# Altium project SkyPulseUAV_Motherboard.PrjPcb
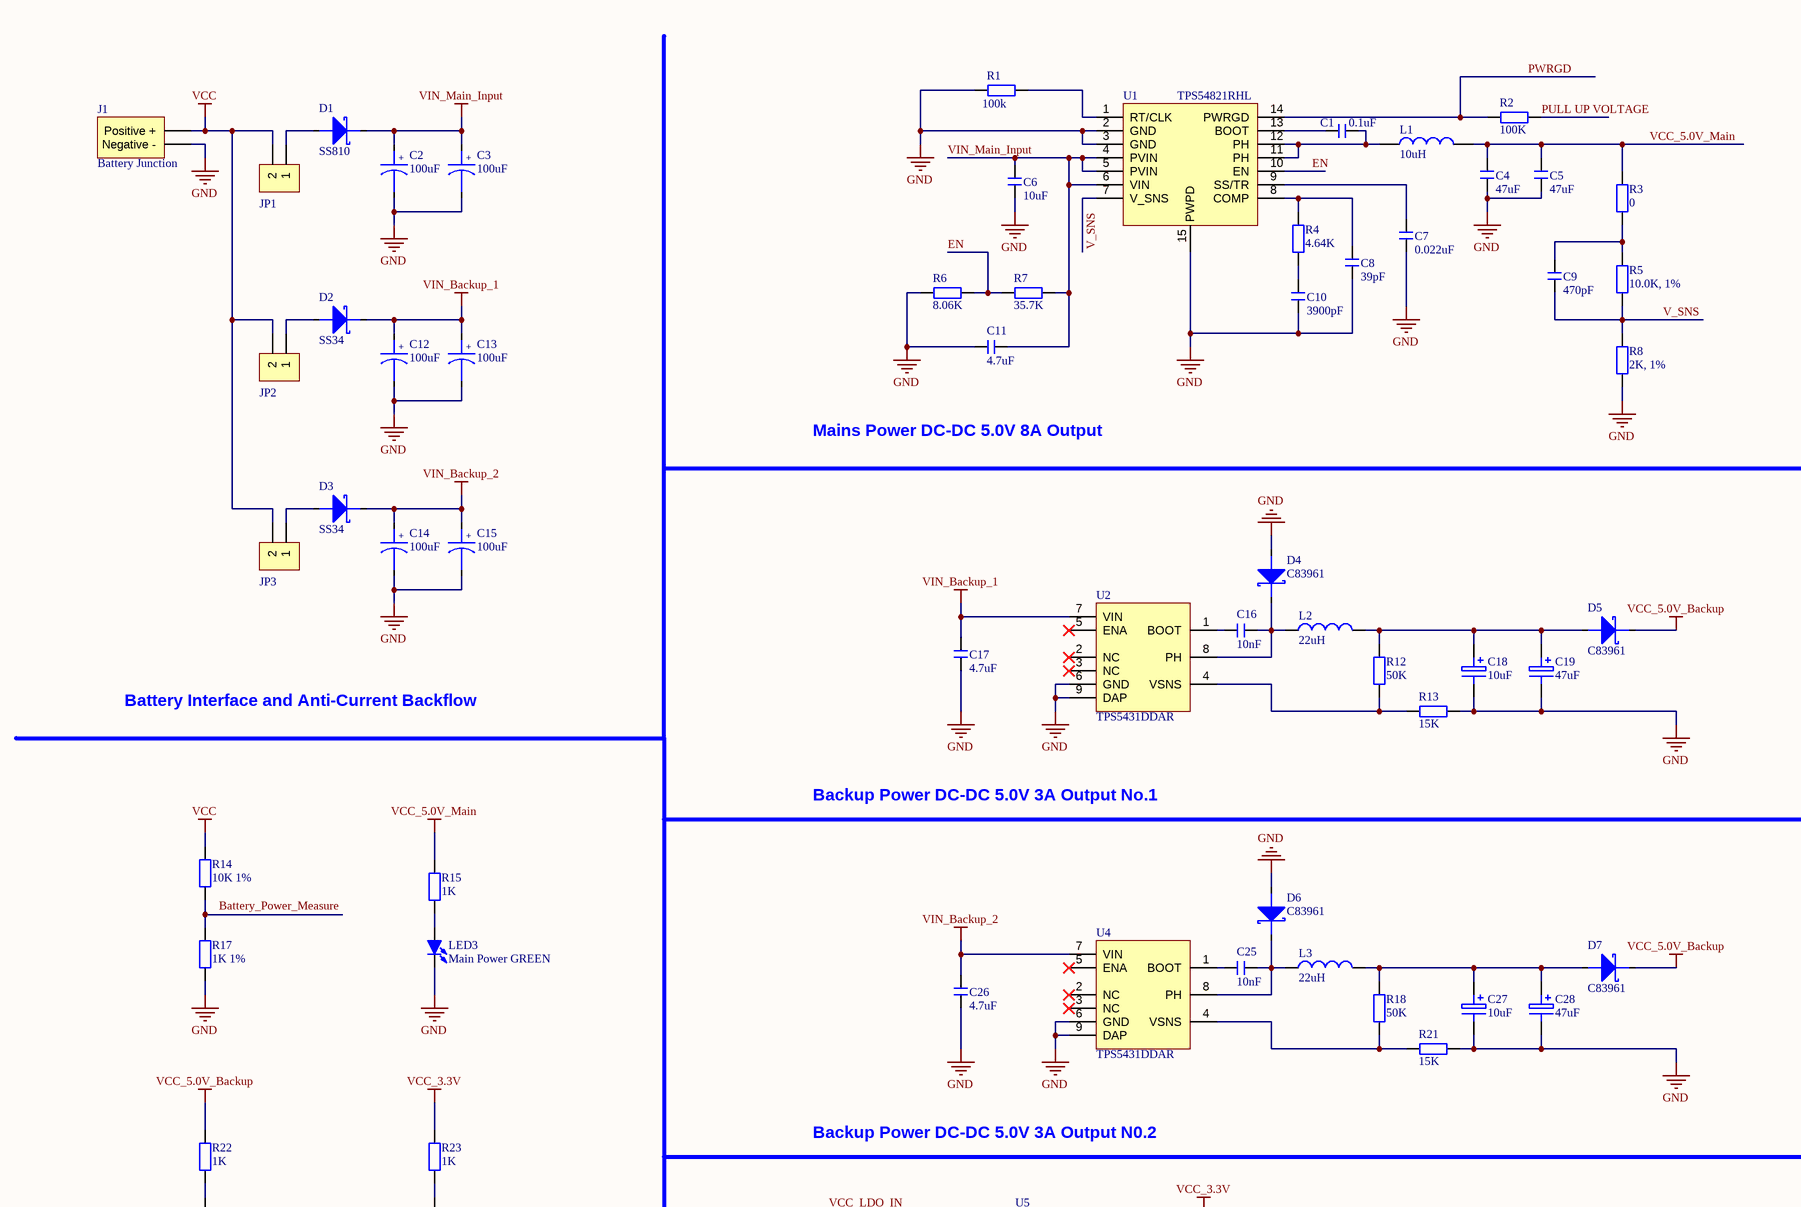
[diagram p0: SkyPulseUAV_Motherboard.SchDoc, top left]
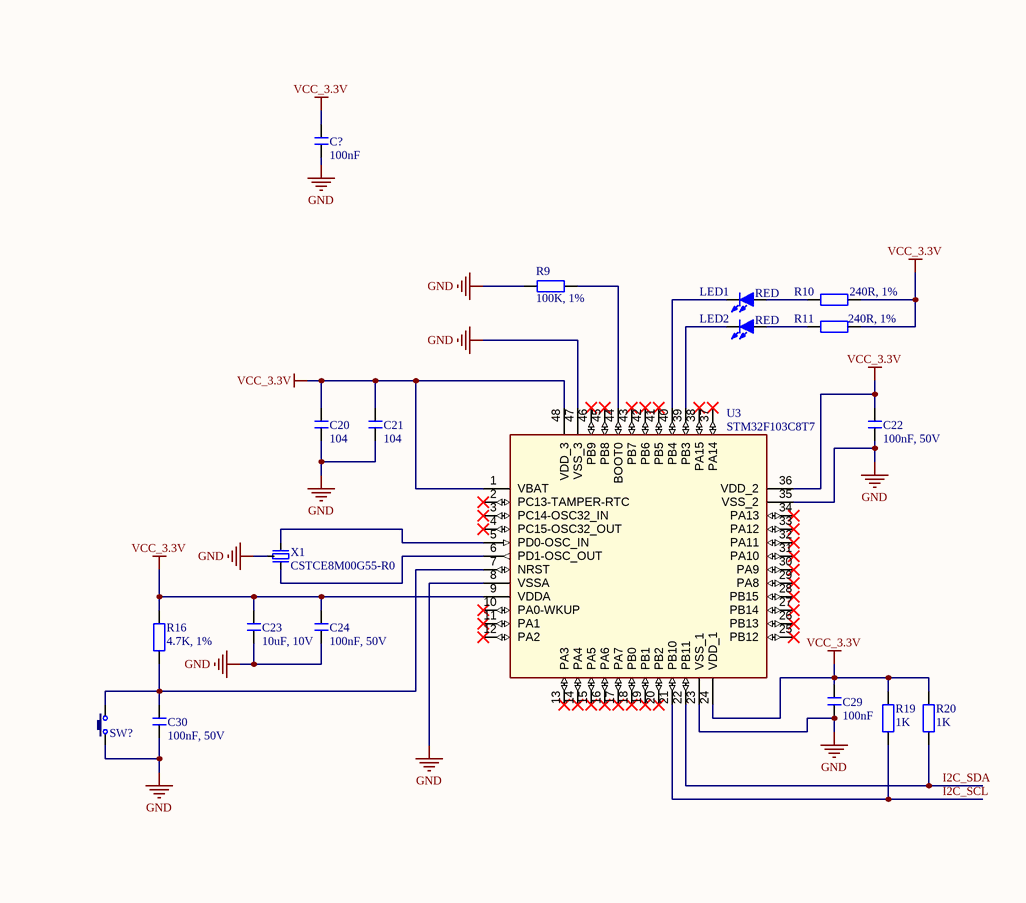
[diagram p1: SkyPulseUAV_Motherboard.SchDoc, top right]
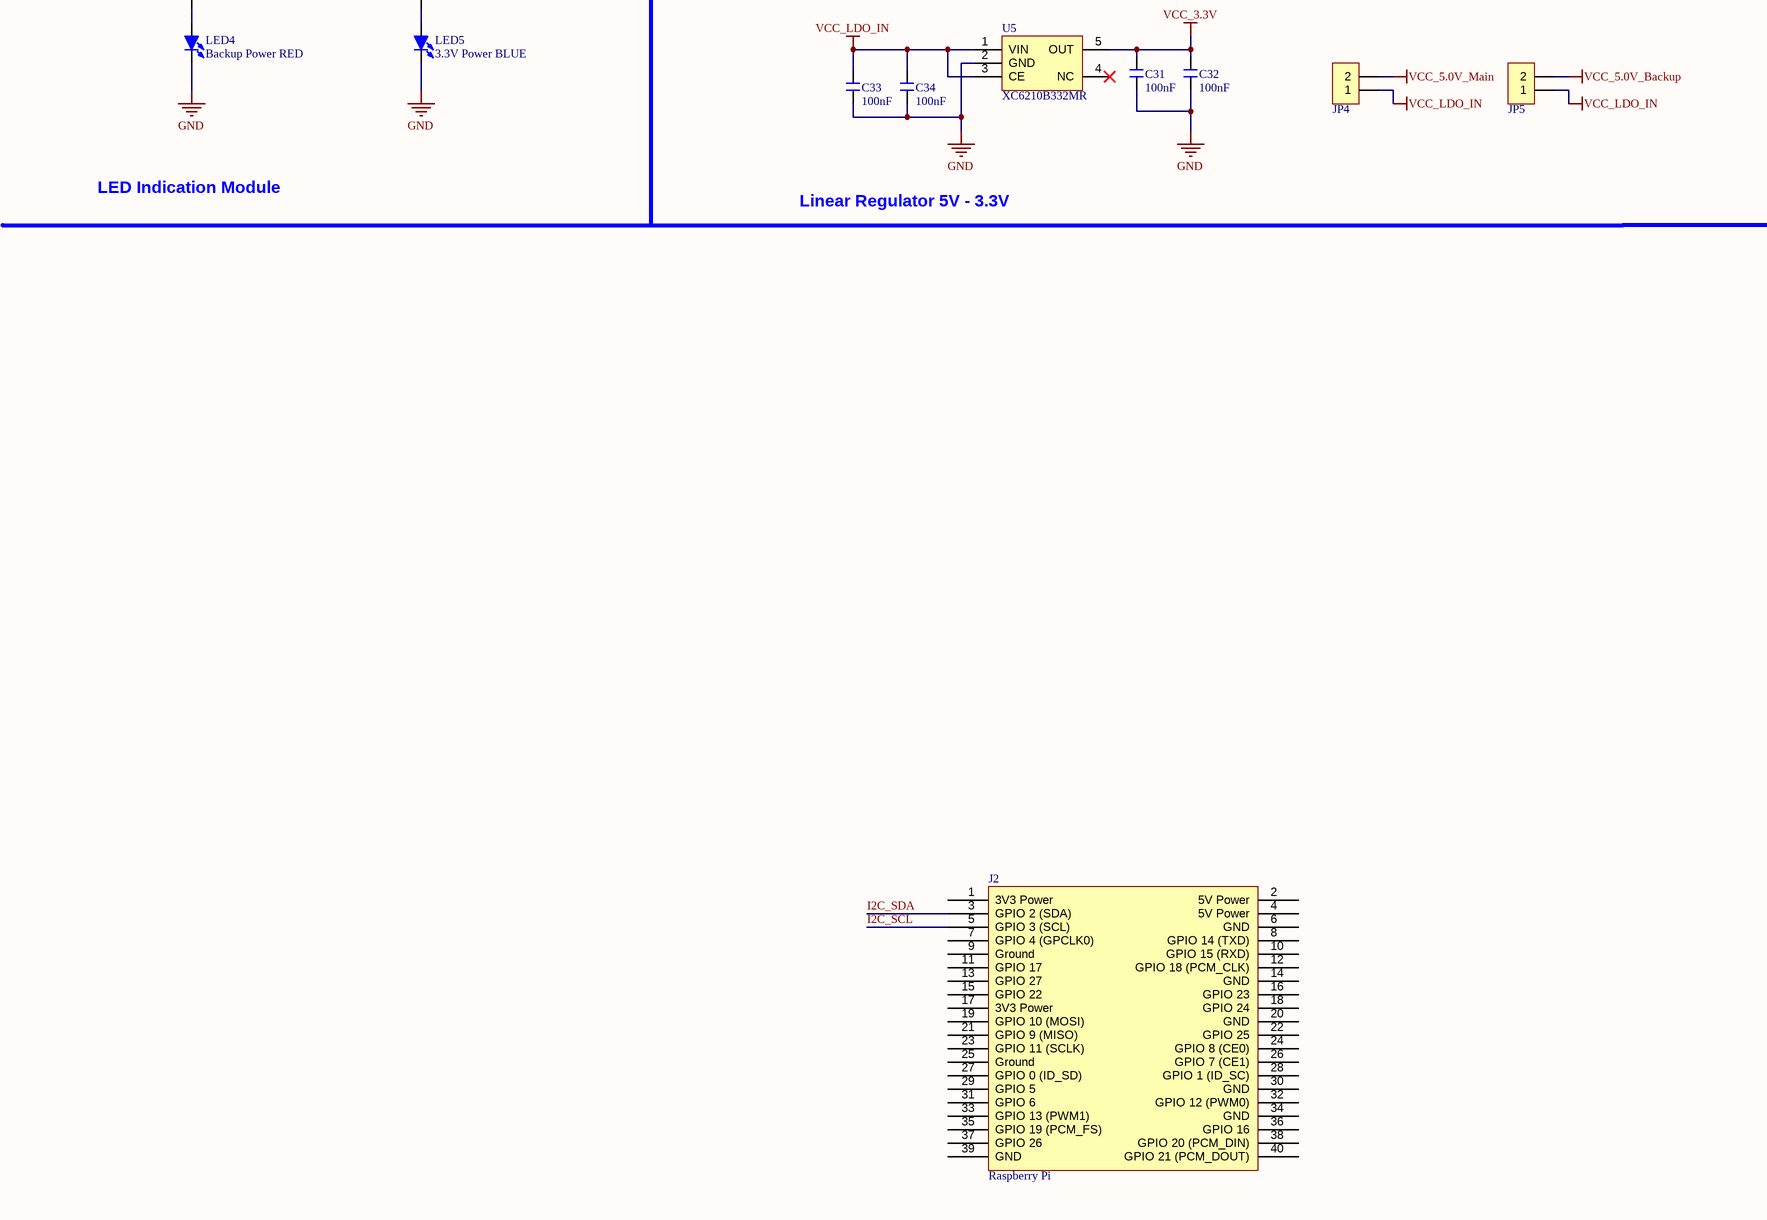
[diagram p2: SkyPulseUAV_Motherboard.SchDoc, bottom left]
4 sheets, 154 parts. Net scope: flat (ports and power ports of the same name join across sheets).
Board file: Motherboard_PCB.PcbDoc
Sheets:
  SkyPulseUAV_Motherboard.SchDoc
  SkyPulseUAV_PowerModule.SchDoc
  SkyPulseUAV_MCU.SchDoc
  SkyPulseUAV_Connector.SchDoc

## Sheet SkyPulseUAV_Motherboard.SchDoc
size 863 x 558 mm; SheetNumber: 1; SheetTotal: 1

### Parts
(Parts that share a designator on the sheet are numbered #1, #2 ... from top to bottom, then left to right.)
C1#1  0.1uF  [C 0805_M]
C2#1  100uF  [CM D(6.3*7.7)]
C3#1  100uF  [CM D(6.3*7.7)]
C4#1  47uF  [C 0805_M]
C5#1  47uF  [C 0805_M]
C6#1  10uF  [C 0805_M]
C7#1  0.022uF  [C 0805_M]
C8#1  39pF  [C 0805_M]
C9#1  470pF  [C 0805_M]
C10#1  3900pF  [C 0805_M]
C11#1  4.7uF  [C 0805_M]
C12#1  100uF  [CM D(6.3*7.7)]
C13#1  100uF  [CM D(6.3*7.7)]
C14#1  100uF  [CM D(6.3*7.7)]
C15#1  100uF  [CM D(6.3*7.7)]
C16#1  10nF  [C 0805_M]
C17#1  4.7uF  [C 0805_M]
C18#1  10uF  [CD B(3528)]
C19#1  47uF  [CD D(7343)]
C20#1  104  [C 0805_M]
C21#1  104  [C 0805_M]
C22#1  100nF, 50V  [C 0805_M]
C23#1  10uF, 10V  [C 0805_M]
C24#1  100nF, 50V  [C 0805_M]
C25#1  10nF  [C 0805_M]
C26#1  4.7uF  [C 0805_M]
C27#1  10uF  [CD B(3528)]
C28#1  47uF  [CD D(7343)]
C29  100nF  [C 0805_M]
C30  100nF, 50V  [C 0805_M]
C31  100nF  [C 0805_M]
C32  100nF  [C 0805_M]
C33  100nF  [C 0603_M]
C34  100nF  [C 0805_M]
C?  100nF  [C 0805_M]
D1#1  SS810  [SMB]
D2#1  SS34  [SMA]
D3#1  SS34  [SMA]
D4#1  C83961  [SMA]
D5  C83961  [SMA]
D6  C83961  [SMA]
D7  C83961  [SMA]
J1#1  Battery Junction
J2#1  Raspberry Pi
JP1  HDR-1X2  (value not drawn)
JP2  HDR-1X2  (value not drawn)
JP3  HDR-1X2  (value not drawn)
JP4  HDR-1X2  (value not drawn)
JP5  HDR-1X2  (value not drawn)
L1#1  10uH  [CD54]
L2#1  22uH  [CD54]
L3  22uH  [CD54]
LED1#1  RED  [LED 0805B]
LED2#1  RED  [LED 0805B]
LED3#1  Main Power GREEN  [LED 0805G]
LED4#1  Backup Power RED  [LED 0805R]
LED5#1  3.3V Power BLUE  [LED 0805B]
R1#1  100k  [R 0805_M]
R2#1  100K  [R 0805_M]
R3#1  0  [R 0805_M]
R4#1  4.64K  [R 0805_M]
R5#1  10.0K, 1%  [R 0805_M]
R6#1  8.06K  [R 0805_M]
R7#1  35.7K  [R 0805_M]
R8#1  2K, 1%  [R 0805_M]
R9#1  100K, 1%  [R 0805_M]
R10#1  240R, 1%  [R 0805_M]
R11#1  240R, 1%  [R 0805_M]
R12#1  50K  [R 0805_M]
R13#1  15K  [R 0805_M]
R14#1  10K 1%  [R 0805_M]
R15#1  1K  [R 0805_M]
R16#1  4.7K, 1%  [R 0805_M]
R17#1  1K 1%  [R 0805_M]
R18#1  50K  [R 0805_M]
R19#1  1K  [R 0805_M]
R20#1  1K  [R 0805_M]
R21#1  15K  [R 0805_M]
R22  1K  [R 0805_M]
R23  1K  [R 0805_M]
SW?  3x6x5  (value not drawn)
U1#1  TPS54821RHL
U2#1  TPS5431DDAR
U3#1  STM32F103C8T7  [TSQFP50P900X900X160-48L]
U4#1  TPS5431DDAR
U5  XC6210B332MR
X1#1  CSTCE8M00G55-R0  [CSTCE_G]

### Nets
GND: C2#1.2 C3#1.2 C4#1.1 C5#1.1 C6#1.1 C7#1.1 C8#1.1 C10#1.1 C11#1.1 C12#1.2 C13#1.2 C14#1.2 C15#1.2 C17#1.1 C18#1.2(E) C19#1.2(E) C20#1.1 C21#1.1 C22#1.1 C23#1.1 C24#1.1 C26#1.1 C27#1.2(E) C28#1.2(E) C29.2 C30.1 C31.2 C32.2 C33.1 C34.1 C?.1 D4#1.1 D6.1 J1#1.2(Negative_-) LED3#1.2(K) LED4#1.2(K) LED5#1.2(K) R1#1.1 R6#1.1 R8#1.1 R9#1.1 R13#1.1 R17#1.1 R21#1.1 SW?.2 U1#1.2(GND) U1#1.3(GND) U1#1.15(PWPD) U2#1.6(GND) U2#1.9(DAP) U3#1.8(VSSA) U3#1.23(VSS_1) U3#1.35(VSS_2) U3#1.47(VSS_3) U4#1.6(GND) U4#1.9(DAP) U5.2(GND) X1#1.2(GND)
VCC: J1#1.1(Positive_+) JP1.2 JP2.2 JP3.2 R14#1.2
VCC_3.3V: C20#1.2 C21#1.2 C22#1.2 C23#1.2 C24#1.2 C29.1 C31.1 C32.1 C?.2 R10#1.2 R11#1.2 R16#1.2 R19#1.2 R20#1.2 R23.2 U3#1.1(VBAT) U3#1.9(VDDA) U3#1.24(VDD_1) U3#1.36(VDD_2) U3#1.48(VDD_3) U5.5(OUT)
VCC_5.0V_Backup: D5.2 D7.2 JP5.2 R22.2
VCC_5.0V_Main: C4#1.2 C5#1.2 JP4.2 L1#1.2 R3#1.2 R15#1.2
VCC_LDO_IN: C33.2 C34.2 JP4.1 JP5.1 U5.1(VIN) U5.3(CE)
VIN_Backup_1: C12#1.1 C13#1.1 C17#1.2 D2#1.2 U2#1.7(VIN)
VIN_Backup_2: C14#1.1 C15#1.1 C26#1.2 D3#1.2 U4#1.7(VIN)
VIN_Main_Input: C2#1.1 C3#1.1 C6#1.2 C11#1.2 D1#1.2 R7#1.2 U1#1.4(PVIN) U1#1.5(PVIN) U1#1.6(VIN)
EN: R6#1.2 R7#1.1 U1#1.10(EN)
I2C_SCL: J2#1.5(GPIO_3_(SCL)) R19#1.1 U3#1.21(PB10)
I2C_SDA: J2#1.3(GPIO_2_(SDA)) R20#1.1 U3#1.22(PB11)
PULL UP VOLTAGE: R2#1.2
PWRGD: R2#1.1 U1#1.14(PWRGD)
V_SNS: C9#1.1 R5#1.1 R8#1.2 U1#1.7(V_SNS)
NetC1#1_1: C1#1.1 L1#1.1 U1#1.11(PH) U1#1.12(PH)
NetC1#1_2: C1#1.2 U1#1.13(BOOT)
NetC7#1_2: C7#1.2 U1#1.9(SS/TR)
NetC8#1_2: C8#1.2 R4#1.2 U1#1.8(COMP)
NetC9#1_2: C9#1.2 R3#1.1 R5#1.2
NetC10#1_2: C10#1.2 R4#1.1
NetC16#1_1: C16#1.1 U2#1.1(BOOT)
NetC16#1_2: C16#1.2 D4#1.2 L2#1.1 U2#1.8(PH)
NetC18#1_1: C18#1.1 C19#1.1 D5.1 L2#1.2 R12#1.2
NetC25#1_1: C25#1.1 U4#1.1(BOOT)
NetC25#1_2: C25#1.2 D6.2 L3.1 U4#1.8(PH)
NetC27#1_1: C27#1.1 C28#1.1 D7.1 L3.2 R18#1.2
NetC30_2: C30.2 R16#1.1 SW?.1 U3#1.7(NRST)
NetD1#1_1: D1#1.1 JP1.1
NetD2#1_1: D2#1.1 JP2.1
NetD3#1_1: D3#1.1 JP3.1
NetLED1#1_1: LED1#1.1(A) R10#1.1
NetLED1#1_2: LED1#1.2(K) U3#1.40(PB4)
NetLED2#1_1: LED2#1.1(A) R11#1.1
NetLED2#1_2: LED2#1.2(K) U3#1.39(PB3)
NetLED3#1_1: LED3#1.1(A) R15#1.1
NetLED4#1_1: LED4#1.1(A) R22.1
NetLED5#1_1: LED5#1.1(A) R23.1
NetR1#1_2: R1#1.2 U1#1.1(RT/CLK)
NetR9#1_2: R9#1.2 U3#1.44(BOOT0)
NetR12#1_1: R12#1.1 R13#1.2 U2#1.4(VSNS)
NetR14#1_1: R14#1.1 R17#1.2
NetR18#1_1: R18#1.1 R21#1.2 U4#1.4(VSNS)
NetU3#1_5: U3#1.5(PD0-OSC_IN) X1#1.1
NetU3#1_6: U3#1.6(PD1-OSC_OUT) X1#1.3

Not connected (* = marked no-connect by the designer): J2#1 1(3V3_Power) 2(5V_Power) 4(5V_Power) 6(GND) 7(GPIO_4_(GPCLK0)) 8(GPIO_14_(TXD)) 9(Ground) 10(GPIO_15_(RXD)) 11(GPIO_17) 12(GPIO_18_(PCM_CLK)) 13(GPIO_27) 14(GND) 15(GPIO_22) 16(GPIO_23) 17(3V3_Power) 18(GPIO_24) 19(GPIO_10_(MOSI)) 20(GND) 21(GPIO_9_(MISO)) 22(GPIO_25) 23(GPIO_11_(SCLK)) 24(GPIO_8_(CE0)) 25(Ground) 26(GPIO_7_(CE1)) 27(GPIO_0_(ID_SD)) 28(GPIO_1_(ID_SC)) 29(GPIO_5) 30(GND) 31(GPIO_6) 32(GPIO_12_(PWM0)) 33(GPIO_13_(PWM1)) 34(GND) 35(GPIO_19_(PCM_FS)) 36(GPIO_16) 37(GPIO_26) 38(GPIO_20_(PCM_DIN)) 39(GND) 40(GPIO_21_(PCM_DOUT)); U2#1 2(NC)* 3(NC)* 5(ENA)*; U3#1 2(PC13-TAMPER-RTC)* 3(PC14-OSC32_IN)* 4(PC15-OSC32_OUT)* 10(PA0-WKUP)* 11(PA1)* 12(PA2)* 13(PA3)* 14(PA4)* 15(PA5)* 16(PA6)* 17(PA7)* 18(PB0)* 19(PB1)* 20(PB2)* 25(PB12)* 26(PB13)* 27(PB14)* 28(PB15)* 29(PA8)* 30(PA9)* 31(PA10)* 32(PA11)* 33(PA12)* 34(PA13)* 37(PA14)* 38(PA15)* 41(PB5)* 42(PB6)* 43(PB7)* 45(PB8)* 46(PB9)*; U4#1 2(NC)* 3(NC)* 5(ENA)*; U5 4(NC)*

### Notes on the sheet
- Mains Power DC-DC 5.0V 8A Output
- Battery Interface and Anti-Current Backflow
- Backup Power DC-DC 5.0V 3A Output No.1
- Backup Power DC-DC 5.0V 3A Output N0.2
- LED Indication Module
- Linear Regulator 5V - 3.3V
- Labels drawn without touching a wire or pin: Battery_Power_Measure
- TITLE:
- SIZE
- D
- AUTHOR:
- REVISION:
- DATA:
- FILE NAME:
- SHEET
- OF
- (in symbol CAP_Electrolytic) +

### Library data of the parts
C1#1 C4#1 C5#1 C6#1 C7#1 C8#1 C9#1 C10#1 C11#1 C16#1 C17#1 C20#1 C21#1 C22#1 C23#1 C24#1 C25#1 C26#1 C29-C34 C? = CAP: SMD Capacitor
C2#1 C3#1 C12#1 C13#1 C14#1 C15#1 = CAP_Electrolytic: SMD Aluminum Electrolytic Capacitors
C18#1 C27#1 = CAP_TAN_10uF: Tantalum capacitor, 10uF, 16V, CA45A-B-16V-10uF-K; Model: CA45A-B-16V-10uF-K
C19#1 C28#1 = CAP_TAN: Tantalum capacitor, 47uF, 16V
D1#1 = SS810: SURFACE MOUNT SCHOTTKY BARRIER RECTIFIER, 8A
D2#1 D3#1 D4#1 D5-D7 = SS34: SURFACE MOUNT SCHOTTKY BARRIER RECTIFIER
J1#1 = Battery Junction: 7.4V, 2S1P, 38.48Wh, 80C, 5200mAh
J2#1 = Raspberry Pi Connector: Raspberry Pi Connector, 40P
JP1-JP5 = Header 2: 2P Jumper
L1#1 L2#1 L3 = L: Inductance
LED1#1 LED2#1 = LED: SMD LED Red
LED3#1 = LED: SMD LED Green
LED4#1 LED5#1 = LED_SMD: SMD LED Red
R1#1 R2#1 R3#1 R4#1 R5#1 R6#1 R7#1 R8#1 R9#1 R10#1 R11#1 R12#1 R13#1 R16#1 R18#1 R19#1 R20#1 R21#1 = RES: SMD Resistor
R14#1 R15#1 R17#1 R22 R23 = RES: SMD Resistor; BOM名称: 贴片电阻; 版权归属: 源创客; 学习资源: www.ooocke.com
SW? = TSW 3x6: Switch
U1#1 = TPS54821RHL: 4.5 V to 17 V Input, 8 A Synchronous Step Down Converter With Hiccup
U2#1 U4#1 = TPS5431DDAR: TPS543x 3A, Wide Input Range, Step-Down Converter
U5 = XC6210B332MR: 800mA, 25uA, Higt PSRR Voltage Regulator
X1#1 = CSTCE8M00G55-R0: Crystal Oscillator CSTCE8M00G55-R0

## Sheet SkyPulseUAV_PowerModule.SchDoc: SkyPulseUAV_Power
size A4; Date: March 2, 2024; Author: Binhan Tian; Revision: V0.2; SheetNumber: 2; SheetTotal: 4
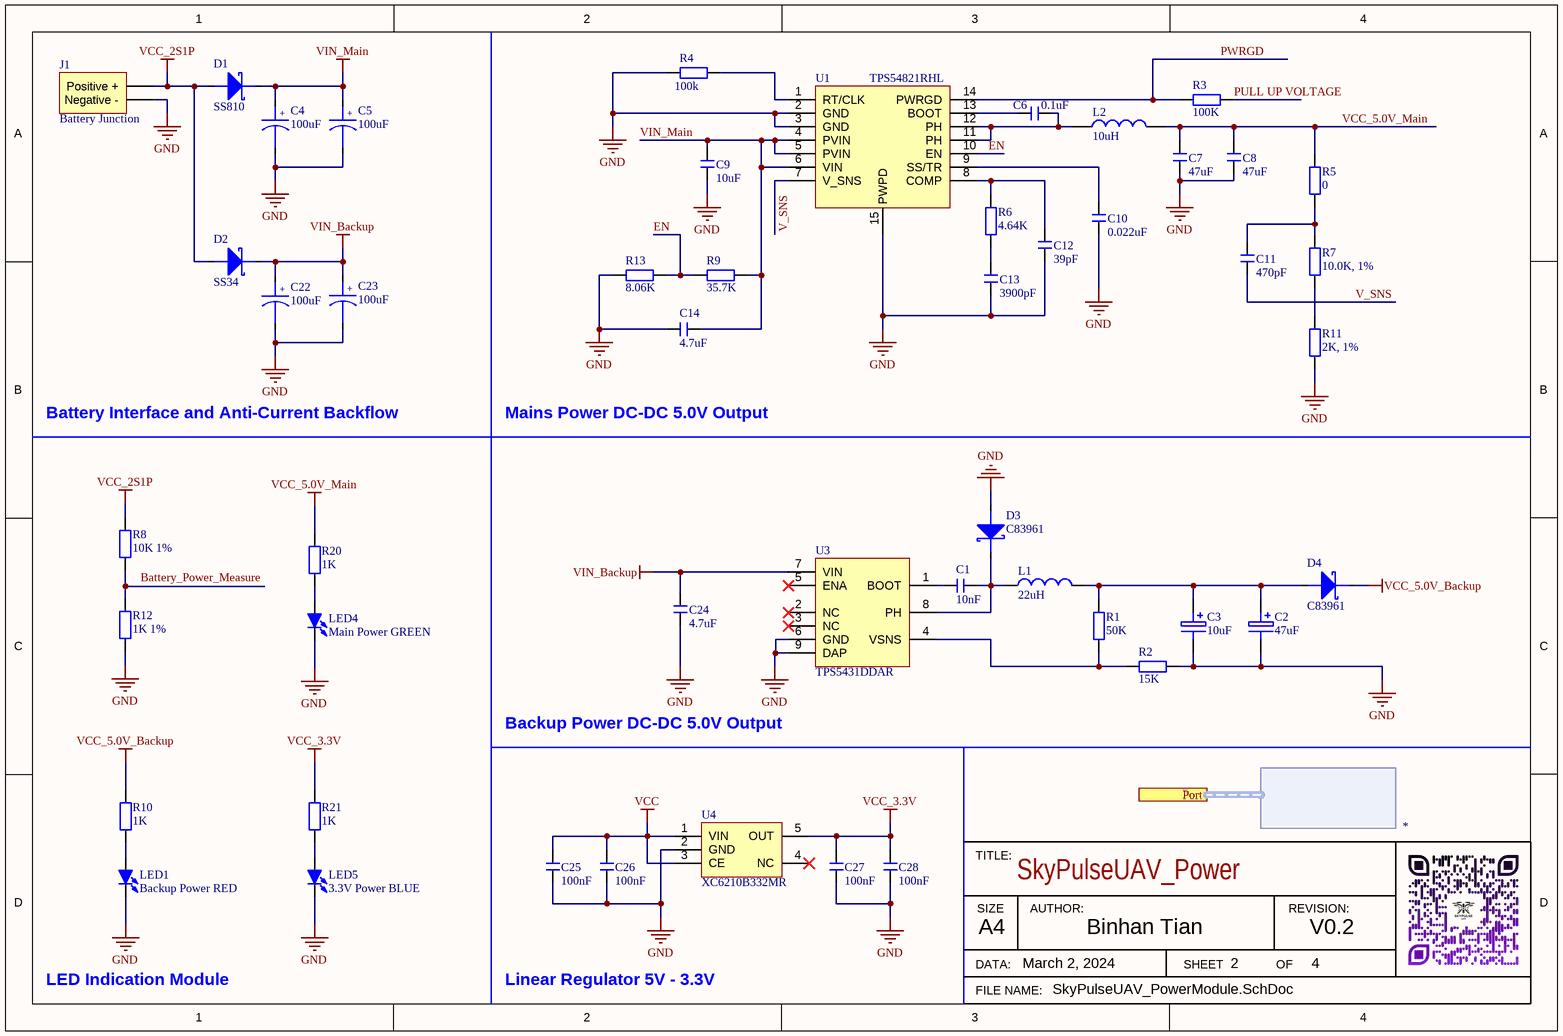
[diagram p3: SkyPulseUAV_PowerModule.SchDoc]

### Parts
(Parts that share a designator on the sheet are numbered #1, #2 ... from top to bottom, then left to right.)
C1#2  10nF  [C 0805_M]
C2#2  47uF  [CD D(7343)]
C3#2  10uF  [CD B(3528)]
C4#2  100uF  [CM D(6.3*7.7)]
C5#2  100uF  [CM D(6.3*7.7)]
C6#2  0.1uF  [C 0805_M]
C7#2  47uF  [C 0805_M]
C8#2  47uF  [C 0805_M]
C9#2  10uF  [C 0805_M]
C10#2  0.022uF  [C 0805_M]
C11#2  470pF  [C 0805_M]
C12#2  39pF  [C 0805_M]
C13#2  3900pF  [C 0805_M]
C14#2  4.7uF  [C 0805_M]
C22#2  100uF  [CM D(6.3*7.7)]
C23#2  100uF  [CM D(6.3*7.7)]
C24#2  4.7uF  [C 0805_M]
C25#2  100nF  [C 0603_M]
C26#2  100nF  [C 0805_M]
C27#2  100nF  [C 0805_M]
C28#2  100nF  [C 0805_M]
D1#2  SS810  [SMB]
D2#2  SS34  [SMA]
D3#2  C83961  [SMA]
D4#2  C83961  [SMA]
J1#2  Battery Junction
L1#2  22uH  [CD54]
L2#2  10uH  [CD54]
LED1#2  Backup Power RED  [LED 0805R]
LED4#2  Main Power GREEN  [LED 0805G]
LED5#2  3.3V Power BLUE  [LED 0805B]
R1#2  50K  [R 0805_M]
R2#2  15K  [R 0805_M]
R3#2  100K  [R 0805_M]
R4#2  100k  [R 0805_M]
R5#2  0  [R 0805_M]
R6#2  4.64K  [R 0805_M]
R7#2  10.0K, 1%  [R 0805_M]
R8#2  10K 1%  [R 0805_M]
R9#2  35.7K  [R 0805_M]
R10#2  1K  [R 0805_M]
R11#2  2K, 1%  [R 0805_M]
R12#2  1K 1%  [R 0805_M]
R13#2  8.06K  [R 0805_M]
R20#2  1K  [R 0805_M]
R21#2  1K  [R 0805_M]
U1#2  TPS54821RHL
U3#2  TPS5431DDAR
U4#2  XC6210B332MR

### Ports
Port (harness *)

### Harnesses
*: 

### Nets
GND: C2#2.2(E) C3#2.2(E) C4#2.2 C5#2.2 C7#2.1 C8#2.1 C9#2.1 C10#2.1 C12#2.1 C13#2.1 C14#2.1 C22#2.2 C23#2.2 C24#2.1 C25#2.1 C26#2.1 C27#2.2 C28#2.2 D3#2.1 J1#2.2(Negative_-) LED1#2.2(K) LED4#2.2(K) LED5#2.2(K) R2#2.1 R4#2.1 R11#2.1 R12#2.1 R13#2.1 U1#2.2(GND) U1#2.3(GND) U1#2.15(PWPD) U3#2.6(GND) U3#2.9(DAP) U4#2.2(GND)
VCC: C25#2.2 C26#2.2 U4#2.1(VIN) U4#2.3(CE)
VCC_2S1P: D1#2.1 D2#2.1 J1#2.1(Positive_+) R8#2.2
VCC_3.3V: C27#2.1 C28#2.1 R21#2.2 U4#2.5(OUT)
VCC_5.0V_Backup: D4#2.2 R10#2.2
VCC_5.0V_Main: C7#2.2 C8#2.2 L2#2.2 R5#2.2 R20#2.2
VIN_Backup: C22#2.1 C23#2.1 C24#2.2 D2#2.2 U3#2.7(VIN)
VIN_Main: C4#2.1 C5#2.1 C9#2.2 C14#2.2 D1#2.2 R9#2.2 U1#2.4(PVIN) U1#2.5(PVIN) U1#2.6(VIN)
EN: R9#2.1 R13#2.2 U1#2.10(EN)
PULL UP VOLTAGE: R3#2.2
PWRGD: R3#2.1 U1#2.14(PWRGD)
V_SNS: C11#2.1 U1#2.7(V_SNS)
NetC1#2_1: C1#2.1 U3#2.1(BOOT)
NetC1#2_2: C1#2.2 D3#2.2 L1#2.1 U3#2.8(PH)
NetC2#2_1: C2#2.1 C3#2.1 D4#2.1 L1#2.2 R1#2.2
NetC6#2_1: C6#2.1 L2#2.1 U1#2.11(PH) U1#2.12(PH)
NetC6#2_2: C6#2.2 U1#2.13(BOOT)
NetC10#2_2: C10#2.2 U1#2.9(SS/TR)
NetC11#2_2: C11#2.2 R5#2.1 R7#2.2
NetC12#2_2: C12#2.2 R6#2.2 U1#2.8(COMP)
NetC13#2_2: C13#2.2 R6#2.1
NetLED1#2_1: LED1#2.1(A) R10#2.1
NetLED4#2_1: LED4#2.1(A) R20#2.1
NetLED5#2_1: LED5#2.1(A) R21#2.1
NetR1#2_1: R1#2.1 R2#2.2 U3#2.4(VSNS)
NetR4#2_2: R4#2.2 U1#2.1(RT/CLK)
NetR7#2_1: R7#2.1 R11#2.2
NetR8#2_1: R8#2.1 R12#2.2

Not connected (* = marked no-connect by the designer): U3#2 2(NC)* 3(NC)* 5(ENA)*; U4#2 4(NC)*

### Notes on the sheet
- Battery Interface and Anti-Current Backflow
- Mains Power DC-DC 5.0V Output
- Backup Power DC-DC 5.0V Output
- LED Indication Module
- Linear Regulator 5V - 3.3V
- Labels drawn without touching a wire or pin: Battery_Power_Measure
- TITLE:
- SIZE
- AUTHOR:
- REVISION:
- DATA:
- FILE NAME:
- A4
- SHEET
- OF
- (in symbol CAP_Electrolytic) +

### Library data of the parts
C1#2 C6#2 C7#2 C8#2 C9#2 C10#2 C11#2 C12#2 C13#2 C14#2 C24#2 C25#2 C26#2 C27#2 C28#2 = CAP: SMD Capacitor
C2#2 = CAP_TAN: Tantalum capacitor, 47uF, 16V
C3#2 = CAP_TAN_10uF: as C18#1 on sheet SkyPulseUAV_Motherboard; Model: CA45A-B-16V-10uF-K
C4#2 C5#2 C22#2 C23#2 = CAP_Electrolytic: SMD Aluminum Electrolytic Capacitors
D1#2 = SS810: as D1#1 on sheet SkyPulseUAV_Motherboard
D2#2 D3#2 D4#2 = SS34: SURFACE MOUNT SCHOTTKY BARRIER RECTIFIER
J1#2 = Battery Junction: 7.4V, 2S1P, 38.48Wh, 80C, 5200mAh
L1#2 L2#2 = L: Inductance
LED1#2 LED5#2 = LED_SMD: SMD LED Red
LED4#2 = LED: SMD LED Green
R1#2 R2#2 R3#2 R4#2 R5#2 R6#2 R7#2 R9#2 R11#2 R13#2 = RES: SMD Resistor
R8#2 R10#2 R12#2 R20#2 R21#2 = RES: SMD Resistor; BOM名称: 贴片电阻; 版权归属: 源创客; 学习资源: www.ooocke.com
U1#2 = TPS54821RHL: as U1#1 on sheet SkyPulseUAV_Motherboard
U3#2 = TPS5431DDAR: as U2#1 on sheet SkyPulseUAV_Motherboard
U4#2 = XC6210B332MR: 800mA, 25uA, Higt PSRR Voltage Regulator

## Sheet SkyPulseUAV_MCU.SchDoc: SkyPulseUAV_MCU
size A4; Date: March 2, 2024; Author: Binhan Tian; Revision: V0.1; SheetNumber: 4; SheetTotal: 5
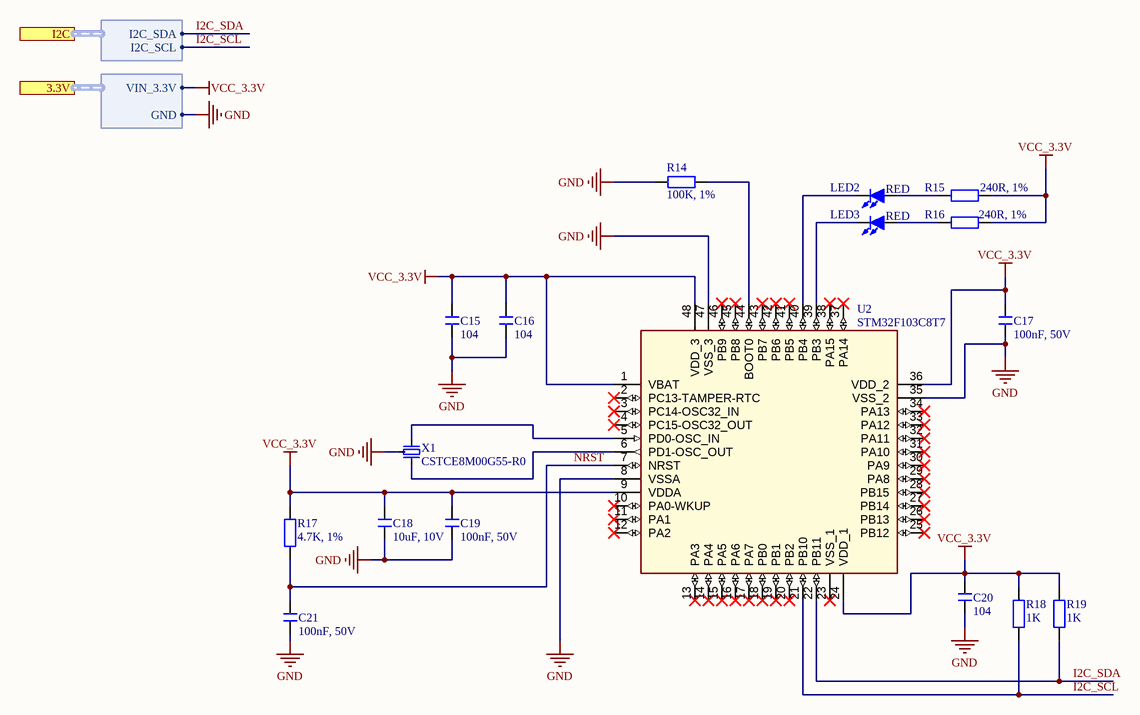
[diagram p4: SkyPulseUAV_MCU.SchDoc]

### Parts
(Parts that share a designator on the sheet are numbered #1, #2 ... from top to bottom, then left to right.)
C15#2  104  [C 0805_M]
C16#2  104  [C 0805_M]
C17#2  100nF, 50V  [C 0805_M]
C18#2  10uF, 10V  [C 0805_M]
C19#2  100nF, 50V  [C 0805_M]
C20#2  104  [C 0805_M]
C21#2  100nF, 50V  [C 0805_M]
LED2#2  RED  [LED 0805B]
LED3#2  RED  [LED 0805B]
R14#2  100K, 1%  [R 0805_M]
R15#2  240R, 1%  [R 0805_M]
R16#2  240R, 1%  [R 0805_M]
R17#2  4.7K, 1%  [R 0805_M]
R18#2  1K  [R 0805_M]
R19#2  1K  [R 0805_M]
U2#2  STM32F103C8T7  [TSQFP50P900X900X160-48L]
X1#2  CSTCE8M00G55-R0  [CSTCE_G]

### Ports
3.3V (harness Power), I2C (harness I2C BUS)

### Harnesses
I2C BUS: I2C_SDA, I2C_SCL
Power: VIN_3.3V, GND

### Nets
GND: C15#2.1 C16#2.1 C17#2.1 C18#2.1 C19#2.1 C20#2.2 C21#2.1 R14#2.1 U2#2.8(VSSA) U2#2.35(VSS_2) U2#2.47(VSS_3) X1#2.2(GND) ; port 3.3V.GND
VCC_3.3V: C15#2.2 C16#2.2 C17#2.2 C18#2.2 C19#2.2 C20#2.1 R15#2.2 R16#2.2 R17#2.2 R18#2.2 R19#2.2 U2#2.1(VBAT) U2#2.9(VDDA) U2#2.24(VDD_1) U2#2.36(VDD_2) U2#2.48(VDD_3) ; port 3.3V.VIN_3.3V
I2C_SCL: R18#2.1 U2#2.21(PB10) ; port I2C.I2C_SCL
I2C_SDA: R19#2.1 U2#2.22(PB11) ; port I2C.I2C_SDA
NRST: C21#2.2 R17#2.1 U2#2.7(NRST)
NetLED2#2_1: LED2#2.1(A) R15#2.1
NetLED2#2_2: LED2#2.2(K) U2#2.40(PB4)
NetLED3#2_1: LED3#2.1(A) R16#2.1
NetLED3#2_2: LED3#2.2(K) U2#2.39(PB3)
NetR14#2_2: R14#2.2 U2#2.44(BOOT0)
NetU2#2_5: U2#2.5(PD0-OSC_IN) X1#2.1
NetU2#2_6: U2#2.6(PD1-OSC_OUT) X1#2.3

Not connected (* = marked no-connect by the designer): U2#2 2(PC13-TAMPER-RTC)* 3(PC14-OSC32_IN)* 4(PC15-OSC32_OUT)* 10(PA0-WKUP)* 11(PA1)* 12(PA2)* 13(PA3)* 14(PA4)* 15(PA5)* 16(PA6)* 17(PA7)* 18(PB0)* 19(PB1)* 20(PB2)* 23(VSS_1)* 25(PB12)* 26(PB13)* 27(PB14)* 28(PB15)* 29(PA8)* 30(PA9)* 31(PA10)* 32(PA11)* 33(PA12)* 34(PA13)* 37(PA14)* 38(PA15)* 41(PB5)* 42(PB6)* 43(PB7)* 45(PB8)* 46(PB9)*

### Notes on the sheet
- TITLE:
- SIZE
- AUTHOR:
- REVISION:
- DATA:
- FILE NAME:
- A4
- SHEET
- OF

### Library data of the parts
C15#2 C16#2 C17#2 C18#2 C19#2 C20#2 C21#2 = CAP: SMD Capacitor
LED2#2 LED3#2 = LED: SMD LED Red
R14#2 R15#2 R16#2 R17#2 R18#2 R19#2 = RES: SMD Resistor
X1#2 = CSTCE8M00G55-R0: Crystal Oscillator CSTCE8M00G55-R0

## Sheet SkyPulseUAV_Connector.SchDoc
size A4; SheetNumber: 5; SheetTotal: 5
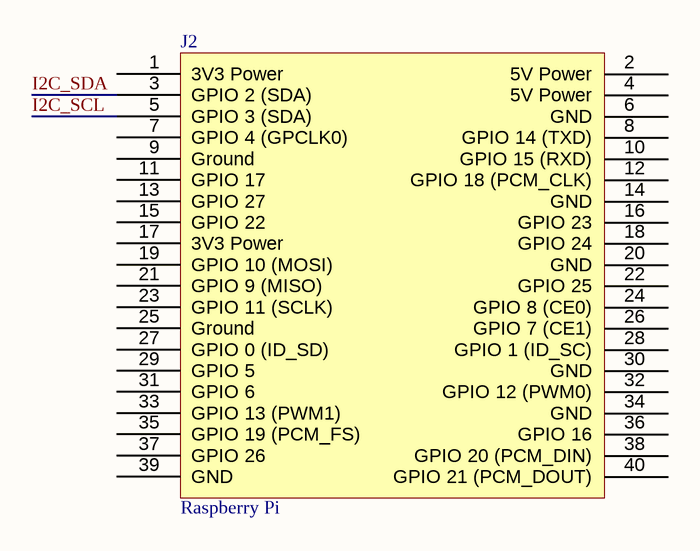
[diagram p5: SkyPulseUAV_Connector.SchDoc]

### Parts
(Parts that share a designator on the sheet are numbered #1, #2 ... from top to bottom, then left to right.)
J2#2  Raspberry Pi

### Nets
I2C_SCL: J2#2.5(GPIO_3_(SDA))
I2C_SDA: J2#2.3(GPIO_2_(SDA))

Not connected (* = marked no-connect by the designer): J2#2 1(3V3_Power) 2(5V_Power) 4(5V_Power) 6(GND) 7(GPIO_4_(GPCLK0)) 8(GPIO_14_(TXD)) 9(Ground) 10(GPIO_15_(RXD)) 11(GPIO_17) 12(GPIO_18_(PCM_CLK)) 13(GPIO_27) 14(GND) 15(GPIO_22) 16(GPIO_23) 17(3V3_Power) 18(GPIO_24) 19(GPIO_10_(MOSI)) 20(GND) 21(GPIO_9_(MISO)) 22(GPIO_25) 23(GPIO_11_(SCLK)) 24(GPIO_8_(CE0)) 25(Ground) 26(GPIO_7_(CE1)) 27(GPIO_0_(ID_SD)) 28(GPIO_1_(ID_SC)) 29(GPIO_5) 30(GND) 31(GPIO_6) 32(GPIO_12_(PWM0)) 33(GPIO_13_(PWM1)) 34(GND) 35(GPIO_19_(PCM_FS)) 36(GPIO_16) 37(GPIO_26) 38(GPIO_20_(PCM_DIN)) 39(GND) 40(GPIO_21_(PCM_DOUT))

### Notes on the sheet
- TITLE:
- SIZE
- AUTHOR:
- REVISION:
- DATA:
- FILE NAME:
- A4
- SHEET
- OF

### Library data of the parts
J2#2 = Raspberry Pi Connector: Raspberry Pi Connector, 40P

## Nets that join several sheets
GND: SkyPulseUAV_Motherboard (58 pins), SkyPulseUAV_PowerModule (34 pins), SkyPulseUAV_MCU (12 pins)
VCC: SkyPulseUAV_Motherboard (5 pins), SkyPulseUAV_PowerModule (C25#2.2 C26#2.2 U4#2.1 U4#2.3)
VCC_3.3V: SkyPulseUAV_Motherboard (21 pins), SkyPulseUAV_PowerModule (C27#2.1 C28#2.1 R21#2.2 U4#2.5), SkyPulseUAV_MCU (16 pins)
VCC_5.0V_Backup: SkyPulseUAV_Motherboard (D5.2 D7.2 JP5.2 R22.2), SkyPulseUAV_PowerModule (D4#2.2 R10#2.2)
VCC_5.0V_Main: SkyPulseUAV_Motherboard (6 pins), SkyPulseUAV_PowerModule (5 pins)